# EasyEDA Pro project PCB_SCH_Right_Sub.epro

# Schematic right_sub
Board Name: right_sub; Create Date: 2025-10-24; Page Name: Sheet_1; Project Name: SCH_right_sub; Schematic Name: right_sub; Update Date: 2025-10-23; Add into BOM: yes; Company: Your Company; Convert to PCB: yes; Date: 10/24/2025; Draw By: Habana; REV: 1.0; Sheet: 1/1; spicePre: .
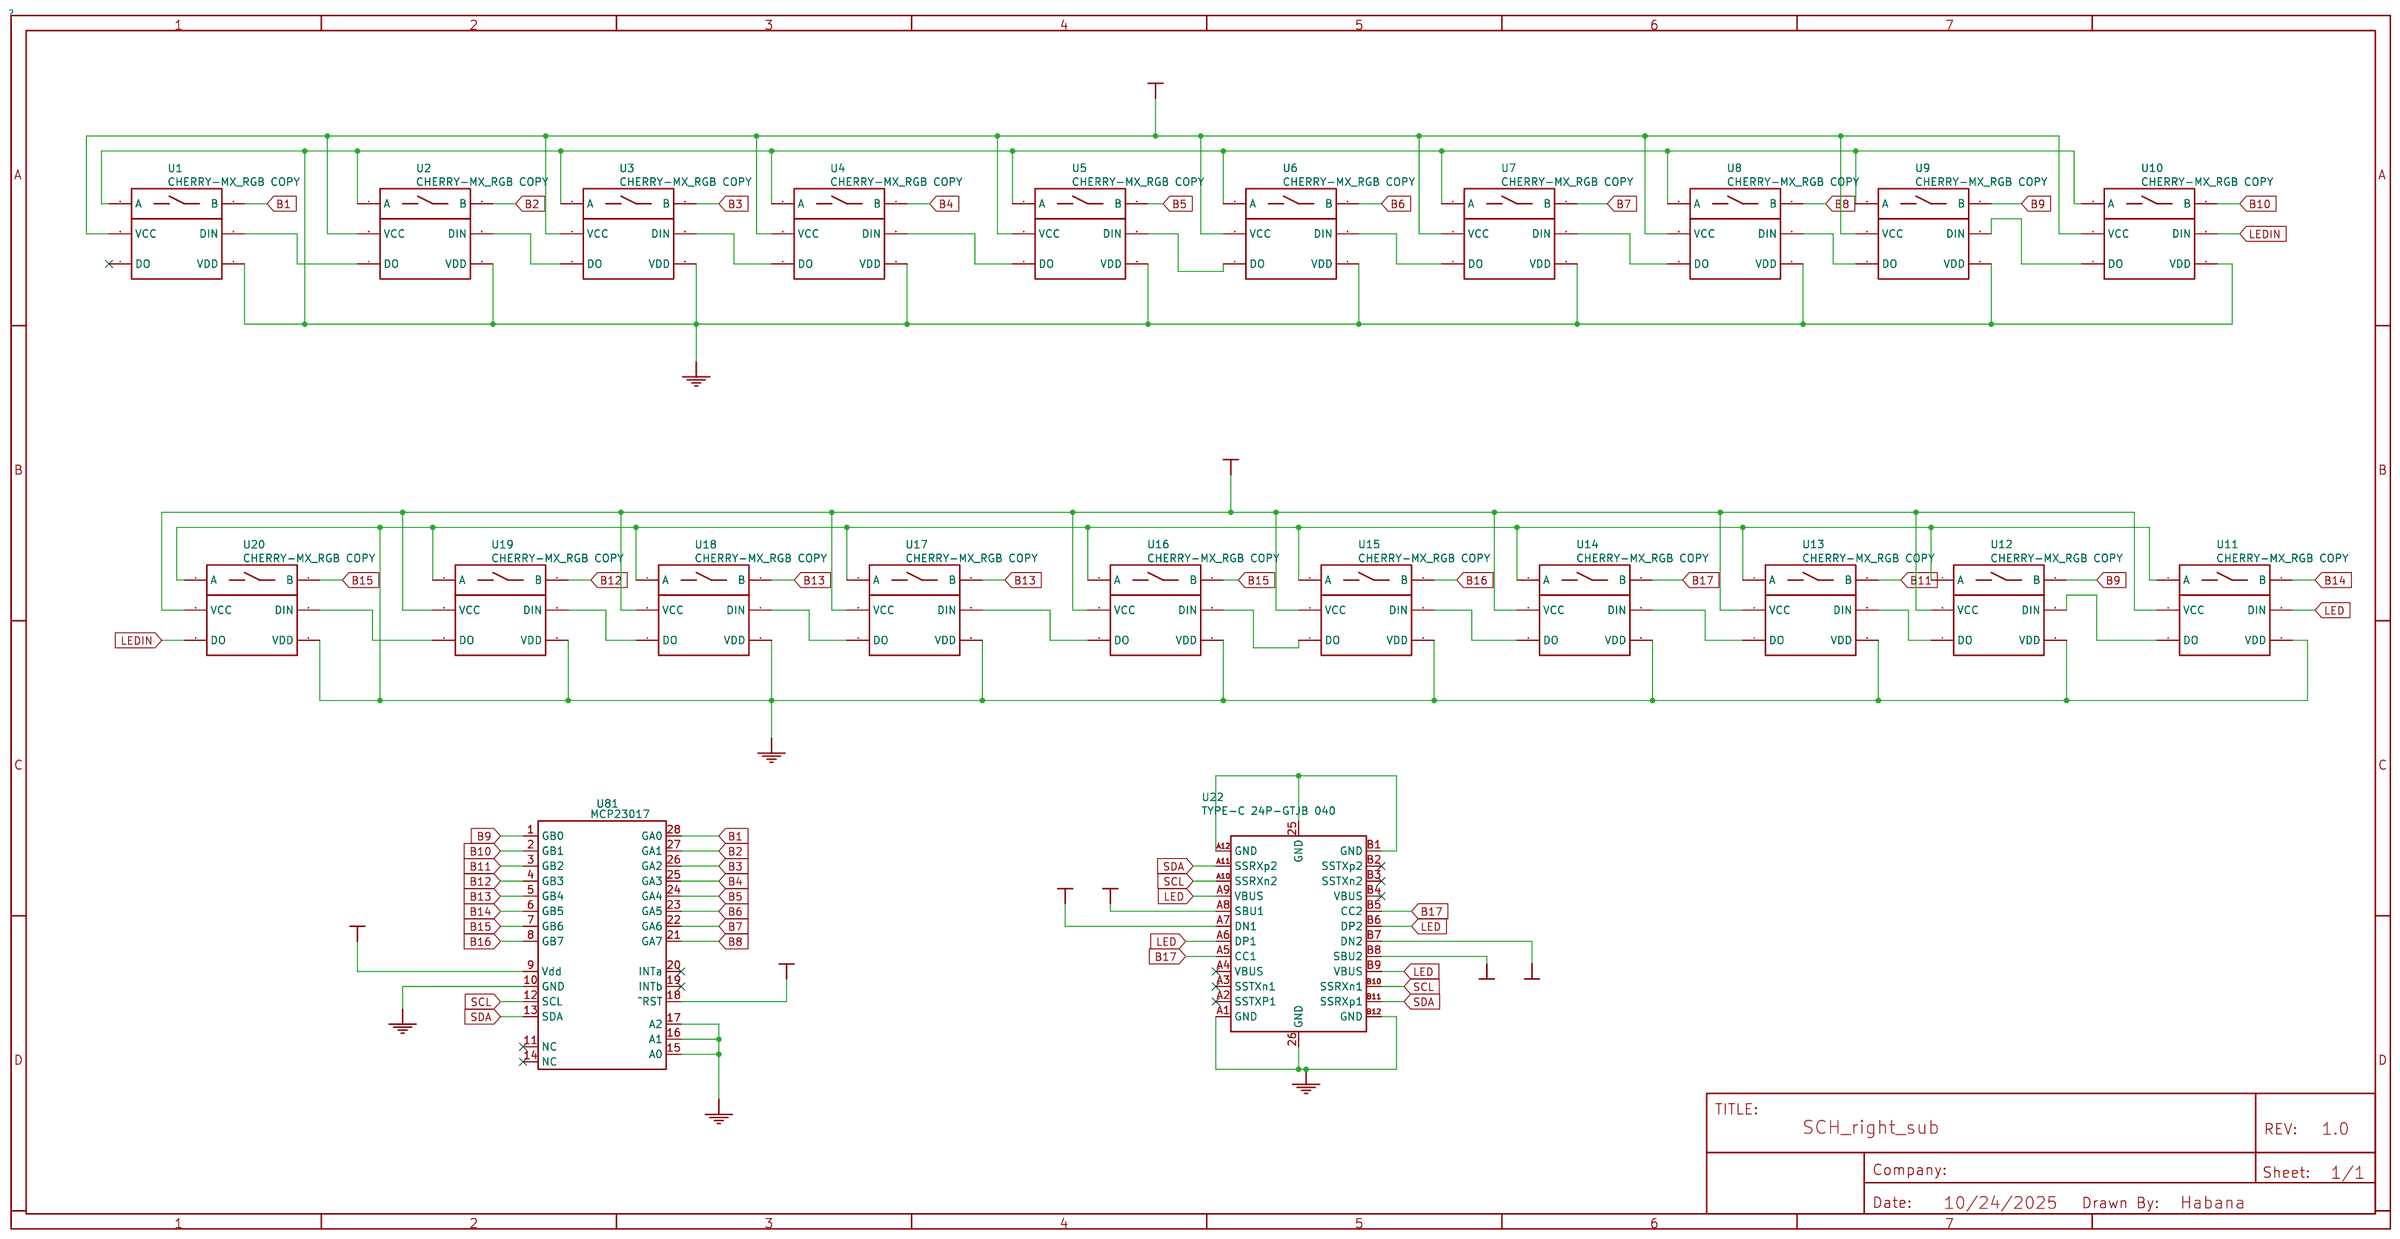
[diagram p0: schematic sheet]

## Parts
U1  CHERRY-MX_RGB COPY
U2  CHERRY-MX_RGB COPY
U3  CHERRY-MX_RGB COPY
U4  CHERRY-MX_RGB COPY
U5  CHERRY-MX_RGB COPY
U6  CHERRY-MX_RGB COPY
U7  CHERRY-MX_RGB COPY
U8  CHERRY-MX_RGB COPY
U9  CHERRY-MX_RGB COPY
U10  CHERRY-MX_RGB COPY
U11  CHERRY-MX_RGB COPY
U12  CHERRY-MX_RGB COPY
U13  CHERRY-MX_RGB COPY
U14  CHERRY-MX_RGB COPY
U15  CHERRY-MX_RGB COPY
U16  CHERRY-MX_RGB COPY
U17  CHERRY-MX_RGB COPY
U18  CHERRY-MX_RGB COPY
U19  CHERRY-MX_RGB COPY
U20  CHERRY-MX_RGB COPY
U22  TYPE-C 24P-GTJB 040  [USB-C-SMD_TYPE-C-24P-GTJB-040]
U81  MCP23017

## Library data of the parts
U1-U20 = CHERRY-MX_RGB COPY: Contributor: unrealin01; spicePre: U
U22 = TYPE-C 24P-GTJB 040: Supplier: LCSC; Supplier Part: C3151751; Manufacturer: SHOU HAN(首韩); JLCPCB Part Class: Extended Part; Contributor: lcsc; spicePre: U
U81 = MCP23017: nameAlias: Model; catid: 20; spicePre: X; Contributor: tsvstar

## Nets
+5V: U1.3(VCC) U2.3(VCC) U3.3(VCC) U4.3(VCC) U5.3(VCC) U6.3(VCC) U7.3(VCC) U8.3(VCC) U9.3(VCC) U10.3(VCC) U11.3(VCC) U12.3(VCC) U13.3(VCC) U14.3(VCC) U15.3(VCC) U16.3(VCC) U17.3(VCC) U18.3(VCC) U19.3(VCC) U20.3(VCC) U22.A8(SBU1) U22.B8(SBU2)
GND: U1.1(A) U1.5(VDD) U2.1(A) U2.5(VDD) U3.1(A) U3.5(VDD) U4.1(A) U4.5(VDD) U5.1(A) U5.5(VDD) U6.1(A) U6.5(VDD) U7.1(A) U7.5(VDD) U8.1(A) U8.5(VDD) U9.1(A) U9.5(VDD) U10.1(A) U10.5(VDD) U11.1(A) U11.5(VDD) U12.1(A) U12.5(VDD) U13.1(A) U13.5(VDD) U14.1(A) U14.5(VDD) U15.1(A) U15.5(VDD) U16.1(A) U16.5(VDD) U17.1(A) U17.5(VDD) U18.1(A) U18.5(VDD) U19.1(A) U19.5(VDD) U20.1(A) U20.5(VDD) U22.26(GND) U22.A1(GND) U22.B12(GND) U81.10(GND) U81.15(A0) U81.16(A1) U81.17(A2)
VCC: U22.A7(DN1) U22.B7(DN2) U81.9(Vdd) U81.18(^RST)
B1: U1.2(B) U81.28(GA0)
B2: U2.2(B) U81.27(GA1)
B3: U3.2(B) U81.26(GA2)
B4: U4.2(B) U81.25(GA3)
B5: U5.2(B) U81.24(GA4)
B6: U6.2(B) U81.23(GA5)
B7: U7.2(B) U81.22(GA6)
B8: U8.2(B) U81.21(GA7)
B9: U9.2(B) U12.2(B) U81.1(GB0)
B10: U10.2(B) U81.2(GB1)
B11: U13.2(B) U81.3(GB2)
B12: U19.2(B) U81.4(GB3)
B13: U17.2(B) U18.2(B) U81.5(GB4)
B14: U11.2(B) U81.6(GB5)
B15: U16.2(B) U20.2(B) U81.7(GB6)
B16: U15.2(B) U81.8(GB7)
B17: U14.2(B) U22.A5(CC1) U22.B5(CC2)
LED: U11.6(DIN) U22.A6(DP1) U22.A9(VBUS) U22.B6(DP2) U22.B9(VBUS)
LEDIN: U10.6(DIN) U20.4(DO)
SCL: U22.A10(SSRXn2) U22.B10(SSRXn1) U81.12(SCL)
SDA: U22.A11(SSRXp2) U22.B11(SSRXp1) U81.13(SDA)
U1_6: U1.6(DIN) U2.4(DO)
U2_6: U2.6(DIN) U3.4(DO)
U3_6: U3.6(DIN) U4.4(DO)
U4_6: U4.6(DIN) U5.4(DO)
U5_6: U5.6(DIN) U6.4(DO)
U6_6: U6.6(DIN) U7.4(DO)
U7_6: U7.6(DIN) U8.4(DO)
U8_6: U8.6(DIN) U9.4(DO)
U9_6: U9.6(DIN) U10.4(DO)
U11_4: U11.4(DO) U12.6(DIN)
U12_4: U12.4(DO) U13.6(DIN)
U13_4: U13.4(DO) U14.6(DIN)
U14_4: U14.4(DO) U15.6(DIN)
U15_4: U15.4(DO) U16.6(DIN)
U16_4: U16.4(DO) U17.6(DIN)
U17_4: U17.4(DO) U18.6(DIN)
U18_4: U18.4(DO) U19.6(DIN)
U19_4: U19.4(DO) U20.6(DIN)
U22_A12: U22.25(GND) U22.A12(GND) U22.B1(GND)

Not connected (* = marked no-connect by the designer): U1 4(DO)*; U22 A2(SSTXP1)* A3(SSTXn1)* A4(VBUS)* B2(SSTXp2)* B3(SSTXn2)* B4(VBUS)*; U81 11(NC)* 14(NC)* 19(INTb)* 20(INTa)*

# Board PCB_PCB_right_sub
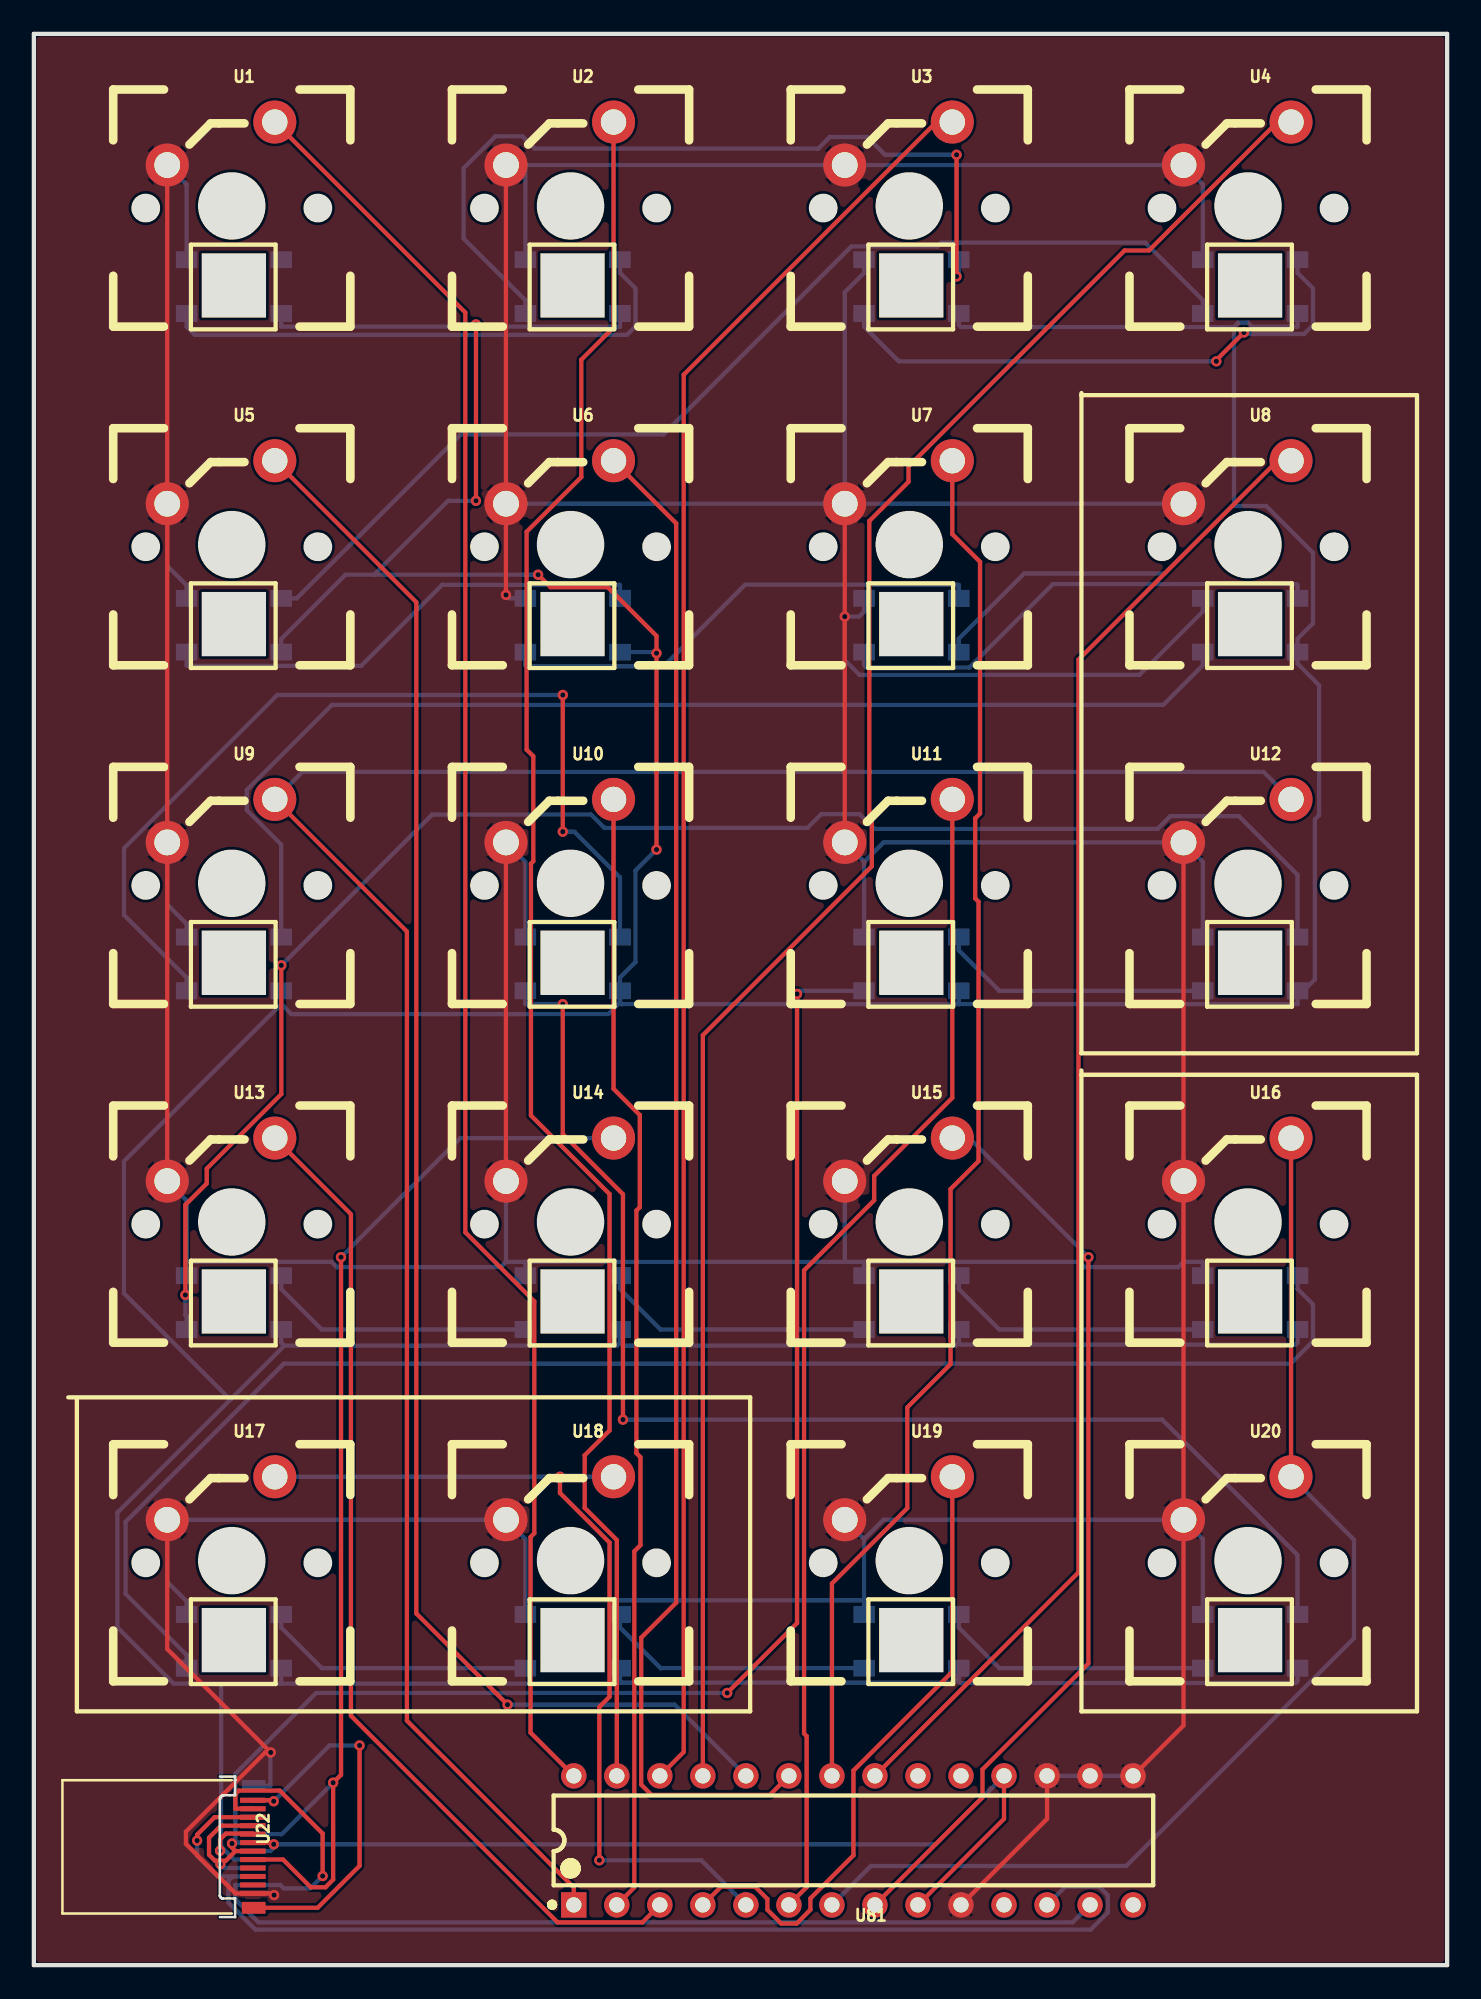
[diagram p1: board, top side]
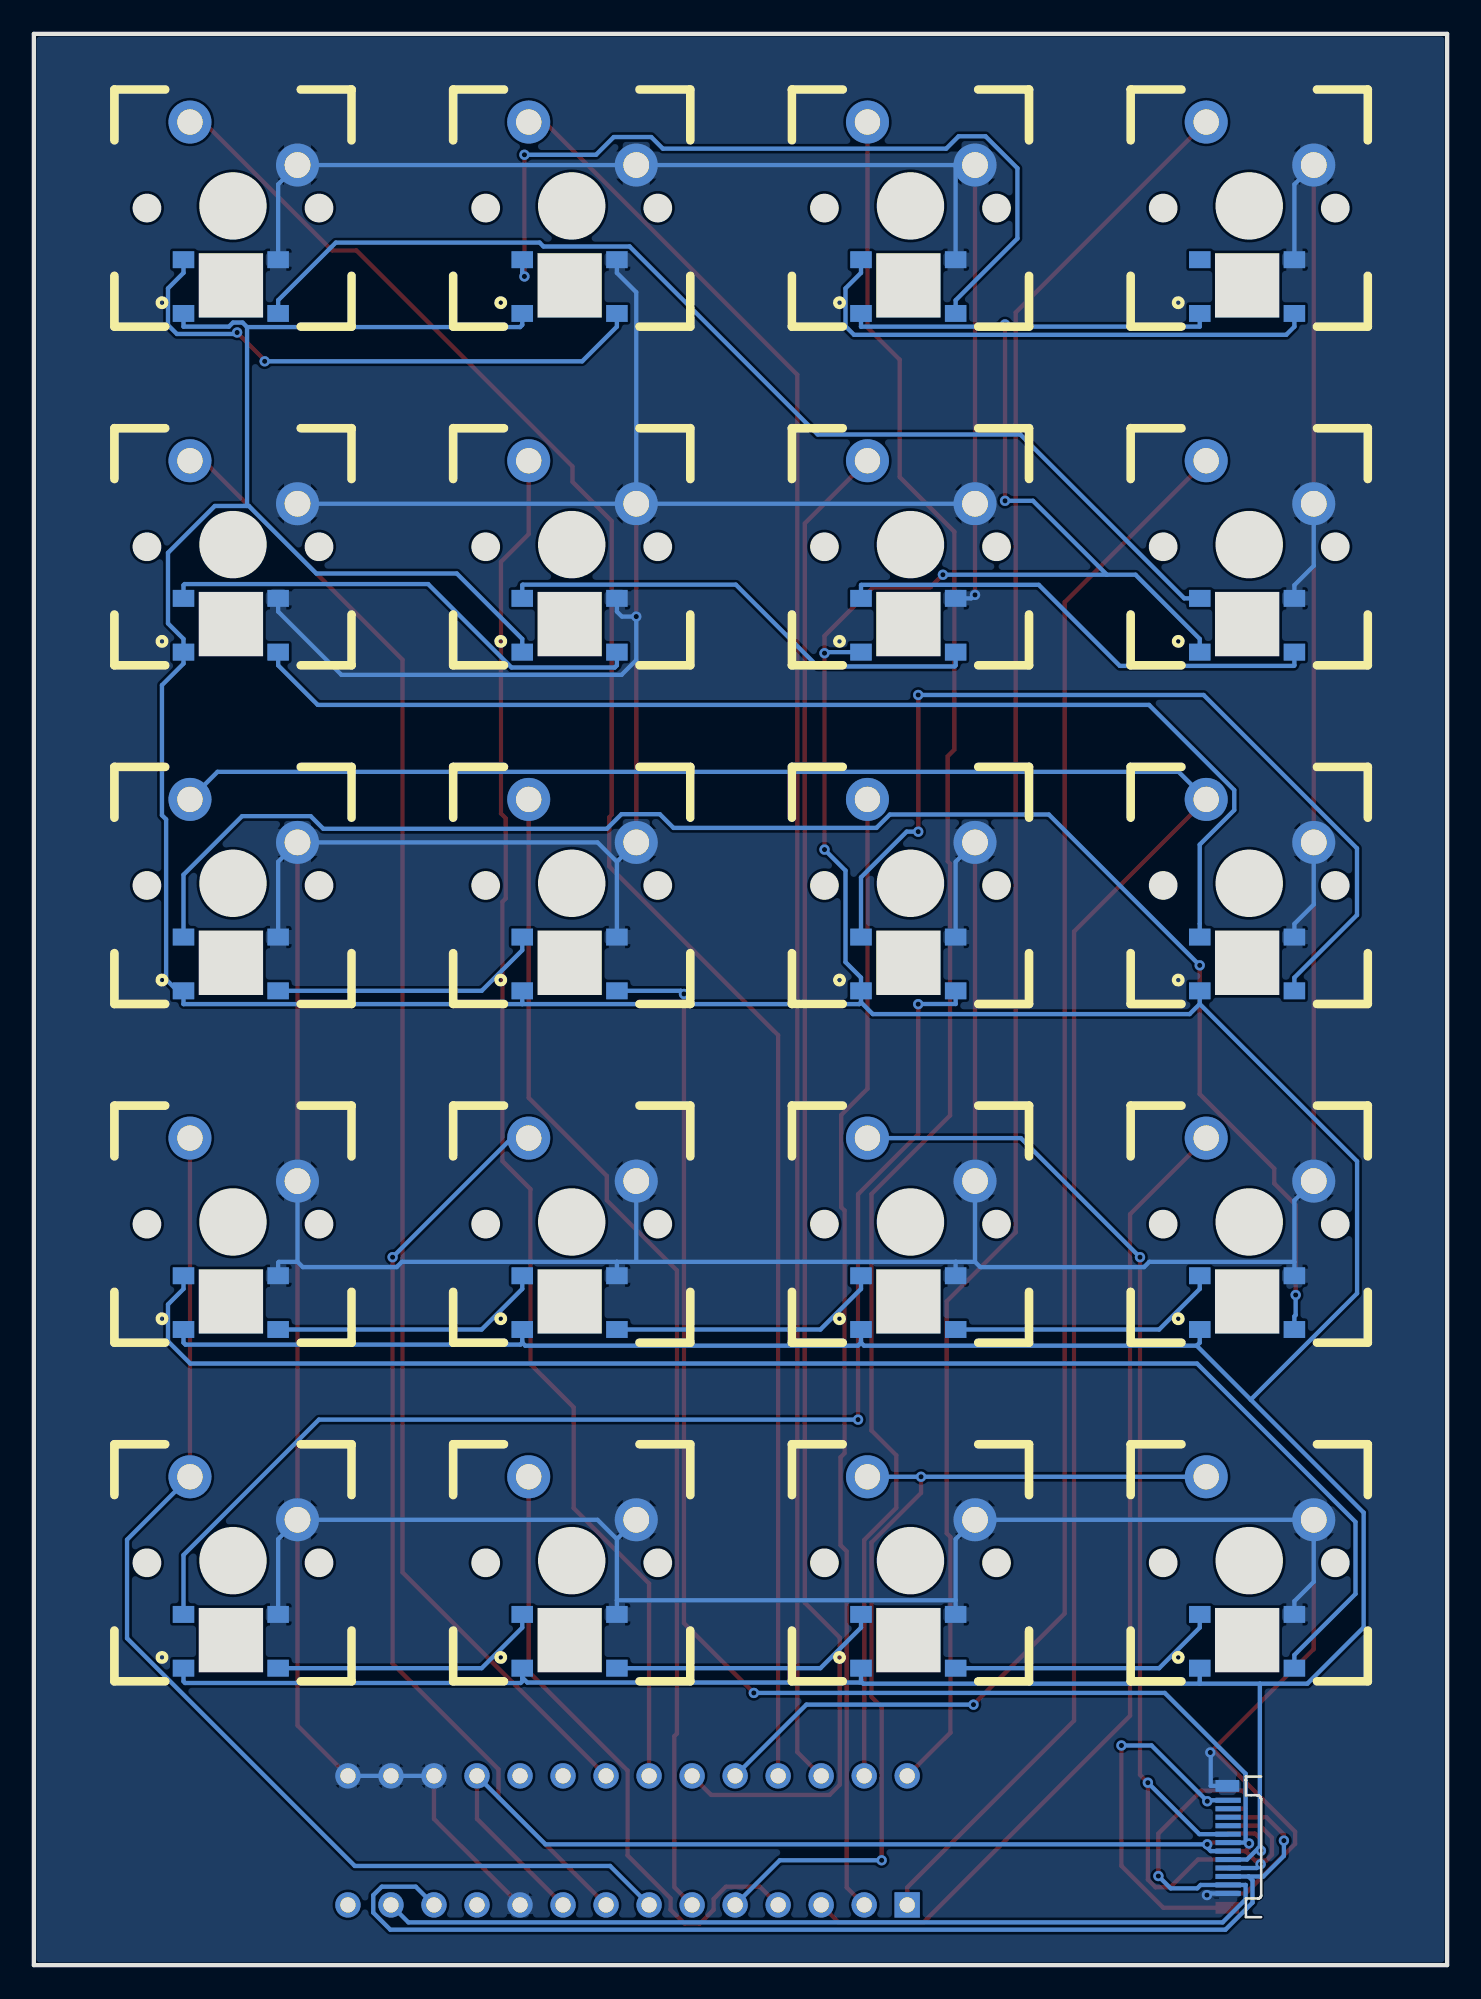
[diagram p2: board, bottom side, seen from below]

Outline 83.44 x 114.05 mm; copper layers: Top Layer, Bottom Layer. Coordinates in mm from the lower left corner of the outline.
Outline path: 0,114.05 83.44,114.05 83.44,0 0,0 0,114.05

## Design rules (mm)
via Default (default): diameter min 0.61, default 0.61, max 100.025; hole min 0.305, default 0.305, max 59.995
pour e205 uses gge21262
pour e589 uses gge21280

## Placement (name value [footprint] x y rotation side)
U1  CHERRY-MX_RGB COPY  [CHERRY-MX-RGB]  13.72 96.9 0 top
U2  CHERRY-MX_RGB COPY  [CHERRY-MX-RGB]  33.72 96.9 0 top
U3  CHERRY-MX_RGB COPY  [CHERRY-MX-RGB]  53.72 96.9 0 top
U4  CHERRY-MX_RGB COPY  [CHERRY-MX-RGB]  73.72 96.9 0 top
U5  CHERRY-MX_RGB COPY  [CHERRY-MX-RGB]  13.72 76.9 0 top
U6  CHERRY-MX_RGB COPY  [CHERRY-MX-RGB]  33.72 76.9 0 top
U7  CHERRY-MX_RGB COPY  [CHERRY-MX-RGB]  53.72 76.9 0 top
U8  CHERRY-MX_RGB COPY  [CHERRY-MX-RGB]  73.72 76.9 0 top
U9  CHERRY-MX_RGB COPY  [CHERRY-MX-RGB]  13.72 56.9 0 top
U10  CHERRY-MX_RGB COPY  [CHERRY-MX-RGB]  33.72 56.9 0 top
U11  CHERRY-MX_RGB COPY  [CHERRY-MX-RGB]  53.72 56.9 0 top
U12  CHERRY-MX_RGB COPY  [CHERRY-MX-RGB]  73.72 56.9 0 top
U13  CHERRY-MX_RGB COPY  [CHERRY-MX-RGB]  13.72 36.9 0 top
U14  CHERRY-MX_RGB COPY  [CHERRY-MX-RGB]  33.72 36.9 0 top
U15  CHERRY-MX_RGB COPY  [CHERRY-MX-RGB]  53.72 36.9 0 top
U16  CHERRY-MX_RGB COPY  [CHERRY-MX-RGB]  73.72 36.9 0 top
U17  CHERRY-MX_RGB COPY  [CHERRY-MX-RGB]  13.72 16.9 0 top
U18  CHERRY-MX_RGB COPY  [CHERRY-MX-RGB]  33.72 16.9 0 top
U19  CHERRY-MX_RGB COPY  [CHERRY-MX-RGB]  53.72 16.9 0 top
U20  CHERRY-MX_RGB COPY  [CHERRY-MX-RGB]  73.72 16.9 0 top
U22  TYPE-C 24P-GTJB 040  [USB-C-SMD_TYPE-C-24P-GTJB-040]  12.95 6.99 270 top
U81  MCP23017  [DIP-28_300MIL]  48.39 7.37 180 top

## Footprints (pads in the part's own frame, mm; a bottom-side part is the same pattern mirrored in y, then rotated)
CHERRY-MX-RGB
  round 2.54 hole 1.524: 1(-5.842,9.398)
  round 2.54 hole 1.5: 2(0.508,11.938)
  rect 1.27x1 smd far side: 3(0.889,0.635) 4(0.889,3.81) 5(-4.699,3.81) 6(-4.699,0.635)
DIP-28_300MIL
  rect 1.5x1.5 hole 0.9: 1(16.51,3.81)
  round 1.5 hole 0.9: 2(13.97,3.81) 3(11.43,3.81) 4(8.89,3.81) 5(6.35,3.81) 6(3.81,3.81) 7(1.27,3.81) 8(-1.27,3.81) 9(-3.81,3.81) 10(-6.35,3.81) 11(-8.89,3.81) 12(-11.43,3.81) 13(-13.97,3.81) 14(-16.51,3.81) 15(-16.51,-3.81) 16(-13.97,-3.81) 17(-11.43,-3.81) 18(-8.89,-3.81) 19(-6.35,-3.81) 20(-3.81,-3.81) 21(-1.27,-3.81) 22(1.27,-3.81) 23(3.81,-3.81) 24(6.35,-3.81) 25(8.89,-3.81) 26(11.43,-3.81) 27(13.97,-3.81) 28(16.51,-3.81)
USB-C-SMD_TYPE-C-24P-GTJB-040
  rect 0.7x1.4 smd: 25(3.6,0.025)
  rect 0.7x1.4 smd far side: 26(-3.6,0.025)
  rect 0.3x1.5 smd: A1(2.75,-0.025) A2(2.25,-0.025) A3(1.75,-0.025) A4(1.25,-0.025) A5(0.75,-0.025) A6(0.25,-0.025) A7(-0.25,-0.025) A8(-0.75,-0.025) A9(-1.25,-0.025) A10(-1.75,-0.025) A11(-2.25,-0.025) A12(-2.75,-0.025)
  rect 0.3x1.5 smd far side: B1(-2.75,-0.025) B2(-2.25,-0.025) B3(-1.75,-0.025) B4(-1.25,-0.025) B5(-0.75,-0.025) B6(-0.25,-0.025) B7(0.25,-0.025) B8(0.75,-0.025) B9(1.25,-0.025) B10(1.75,-0.025) B11(2.25,-0.025) B12(2.75,-0.025)

## Nets
As in the schematic.

Pads without a net: U1 4; U22 A2 A3 A4 B2 B3 B4; U81 11 14 19 20

## Via types
v1: diameter 0.61, hole 0.305, Top Layer to Bottom Layer, 35 vias

## Routing (per net, layer and track width the routed paths; a pad name or vN(x,y) marks a point on that pad's centre or on a via; arc(x,y) is an arc through that point)
+5V: length 443
  Top Layer w0.254: v1(36.76,65.88) v1(36.76,77.47) 36.76,78.5 33.88,81.37 30.5,81.37 v1(29.77,82.11) ; v1(10.99,6.76) 10.99,7.42 11.34,7.77 12.89,7.77 U22.A8 ; v1(26.1,86.47) v1(26.1,96.89)
  Bottom Layer w0.254: 70.85,86.17 72.75,86.17 75.52,83.4 75.52,79.23 74.61,78.32 U8.3 74.61,76.86 75.88,75.59 75.88,67.9 75.63,67.66 75.63,58.21 74.61,57.18 ; 70.85,86.17 70.75,86.17 66.76,82.18 58.47,82.18 54.61,78.32 U7.3 ; 70.85,86.17 70.85,96.73 ; 14.78,36.58 11.59,33.39 ; 14.78,36.58 14.6,36.76 U13.3 ; 14.78,36.58 34.43,36.58 34.61,36.76 ; 11.59,33.39 4.93,26.72 4.93,19.95 8.25,16.62 11.06,16.62 ; 11.59,33.39 5.32,39.67 5.32,47.47 14.6,56.76 ; U3.3 54.61,96.86 54.73,96.73 70.85,96.73 ; 11.06,16.62 14.6,16.62 ; 11.06,16.62 11.06,7 11.14,6.91 ; 14.6,16.62 34.47,16.62 34.61,16.76 ; 14.6,16.62 U17.3 ; 34.61,56.86 34.71,56.75 54.61,56.75 ; 34.61,56.86 33.91,56.16 15.2,56.16 14.6,56.76 ; 34.61,56.86 U10.3 34.61,58.32 35.52,59.23 35.52,64.64 v1(36.76,65.88) ; 34.61,16.76 34.68,16.69 54.3,16.69 54.61,16.99 ; 34.61,16.76 U18.3 ; 14.6,56.76 U9.3 ; v1(36.76,77.47) 36.7,77.54 U6.3 ; 54.61,36.76 U15.3 ; 54.61,36.76 54.43,36.58 34.78,36.58 34.61,36.76 ; 54.61,36.76 54.72,36.64 74.49,36.64 74.61,36.76 U16.3 ; 70.85,96.73 71.12,97 71.68,97 71.92,96.76 74.61,96.76 U4.3 ; 26.1,96.76 14.6,96.76 U1.3 ; 26.1,96.76 26.1,96.76 34.6,96.76 34.61,96.76 U2.3 ; 26.1,96.76 v1(26.1,96.89) ; 54.61,16.99 54.61,16.76 54.7,16.66 74.51,16.66 74.61,16.76 U20.3 ; 54.61,16.99 U19.3 ; 34.61,36.76 U14.3 ; 11.14,6.91 v1(10.99,6.76) ; 11.14,6.91 11.82,6.24 U22.B8 ; 54.61,56.75 U11.3 ; 54.61,56.75 74.6,56.75 74.61,56.76 74.61,57.18 ; 74.61,57.18 U12.3 ; 20.09,82.11 v1(29.77,82.11) ; 20.09,82.11 24.45,86.47 v1(26.1,86.47) ; 20.09,82.11 18.4,82.11 14.6,78.32 U5.3
GND: length 590
  Top Layer w0.254: U12.1 U16.1 U20.1 67.87,14.15 U81.15 ; U1.1 U5.1 U9.1 U13.1 ; 27.87,80.92 U6.1 U2.1 ; U7.1 v1(47.87,79.64) U11.1 ; v1(14.18,4.14) 14.08,4.24 U22.A1 11.9,4.24 8.98,7.16 8.98,7.88 13.65,12.56 v1(13.98,12.56) 7.87,18.67 U17.1 ; U81.10 59.82,8.64 U81.17 ; U10.1 U14.1
  Bottom Layer w0.254: 67.87,41.53 67.56,41.22 62.02,41.22 61.7,41.53 49.02,41.53 ; 67.87,41.53 U16.1 ; 67.87,41.53 68.97,41.53 69.02,41.49 U16.5 ; 47.87,41.53 49.02,41.53 ; 47.87,41.53 U15.1 ; 47.87,41.53 29.02,41.53 ; 49.02,41.53 U15.5 ; U10.1 29.02,65.16 U10.5 ; 29.02,21.55 U18.5 ; 29.02,21.55 49.02,21.55 ; 29.02,21.55 29.02,25.16 U18.1 U17.1 7.87,22.63 9.02,21.49 U17.5 ; 49.02,21.55 49.02,25.16 ; 49.02,21.55 U19.5 ; 29.02,41.53 27.87,41.53 ; 29.02,41.53 U14.5 ; 49.02,25.16 50.16,26.3 U20.1 69.02,25.16 U20.5 ; 49.02,25.16 U19.1 ; U5.1 7.87,82.63 9.02,81.49 U5.5 ; 27.87,41.53 27.56,41.22 17.89,41.22 17.58,41.53 9.02,41.53 ; 27.87,41.53 U14.1 ; U6.1 U7.1 ; U7.1 47.87,98.79 49.02,99.93 U3.5 ; U7.1 U8.1 ; v1(14.18,4.14) 14.06,4.14 13.96,4.24 U22.A1 ; U8.5 69.02,79.93 65.28,76.2 48.74,76.2 47.87,77.06 v1(47.87,79.64) 48.72,79.64 49.02,79.93 U7.5 ; 29.02,106.3 U2.5 ; 29.02,106.3 U3.1 U4.1 69.02,105.16 U4.5 ; 29.02,106.3 U2.1 ; 27.87,80.92 27.9,80.92 28.1,80.71 U6.5 ; U22.26 13.96,10.59 13.96,12.53 v1(13.98,12.56) ; U1.5 9.02,105.16 U1.1 ; U81.15 U81.16 U81.17 ; 9.02,41.53 U13.5 ; 9.02,41.53 9.02,45.16 U13.1 ; U11.1 49.02,65.16 ; 49.02,65.16 50.16,66.3 U12.1 69.02,65.16 U12.5 ; 49.02,65.16 U11.5 ; U9.5 9.02,61.49 7.87,62.63 U9.1
  vias: v1(27.87,80.92)
VCC: length 57.3
  Top Layer w0.254: v1(14.16,7.13) 14.06,7.24 U22.A7 ; U81.9 57.28,8.64 U81.18
  Bottom Layer w0.254: U81.18 53.23,7.13 v1(14.16,7.13) 14.16,6.94 13.96,6.74 U22.B7
B1: length 105.2
  Top Layer w0.254: U1.2 25.47,97.59 25.47,43.27 29.55,39.2 29.55,25.5 29.33,25.28 29.33,13.73 U81.28
B2: length 103.3
  Top Layer w0.254: U81.27 34.42,25.1 32.52,27 32.52,30.11 33.99,31.57 33.99,45.53 29.35,50.17 29.35,65.05 29.49,65.19 29.49,71.38 29.09,71.78 29.09,84.65 32.32,87.87 32.32,94.8 34.22,96.71 U2.2
B3: length 105.4
  Top Layer w0.254: U81.26 38.37,12.59 38.37,93.92 53.28,108.84 U3.2
B4: length 113.5
  Top Layer w0.254: U4.2 73.42,108.84 65.84,101.26 64.4,101.26 51.64,88.5 51.64,87.59 49.33,85.28 49.33,67.93 49.47,67.79 49.47,64.89 39.5,54.92 U81.25
B5: length 95
  Top Layer w0.254: 27.96,15.38 22.58,20.77 22.58,80.48 U5.2
  Bottom Layer w0.254: 27.96,15.38 37.83,15.38 U81.24
  vias: v1(27.96,15.38)
B6: length 90
  Top Layer w0.254: U81.23 43.45,10.05 36.46,10.05 35.86,10.66 35.86,19.34 37.92,21.4 37.92,85.14 U6.2
B7: length 82.1
  Top Layer w0.254: U7.2 54.22,84.51 55.86,82.87 55.86,68.01 55.58,67.72 55.58,62.99 55.77,62.8 55.77,47.48 54.12,45.83 54.12,35.49 51.57,32.94 51.57,26.99 47.12,22.54 U81.22
B8: length 88.3
  Top Layer w0.254: U81.21 61.67,23.19 61.67,77.09 73.42,88.84 U8.2
B9: length 133.9
  Top Layer w0.254: U81.1 31.88,4.59 22.02,14.44 22.02,61.04 U9.2
  Bottom Layer w0.254: U12.2 72.6,70.47 15.85,70.47 U9.2
B10: length 66.7
  Top Layer w0.254: U81.2 35.45,4.59 35.45,24.43 35.81,24.8 35.81,29.99 35.57,30.23 35.57,44.56 35.77,44.76 35.77,50.2 34.22,51.75 U10.2
B11: length 59.7
  Top Layer w0.254: U13.2 18.72,44.34 18.72,14.73 30.92,2.53 35.93,2.53 U81.3
B12: length 37.4
  Top Layer w0.254: U19.2 54.22,17.32 48.39,11.49 48.39,6.48 45.85,3.94 45.85,3.27 45.03,2.45 44.12,2.45 43.31,3.27 43.31,3.91 42.58,4.63 40.57,4.63 U81.4
B13: length 53.9
  Top Layer w0.254: v1(31.06,28.84) 31.06,27.88 33.99,24.96 33.99,15.85 33.39,15.25 33.39,6.19
  Bottom Layer w0.254: 33.39,6.19 39.4,6.19 U81.5 ; U17.2 v1(31.06,28.84) U18.2
  vias: v1(33.39,6.19)
B14: length 69.4
  Top Layer w0.254: U11.2 54.22,51.22 49.61,46.61 49.61,45.17 45.47,41.03 45.47,13.68 45.63,13.52 45.63,4.6 U81.6
B15: length 68.4
  Top Layer w0.254: U20.2 U16.2
  Bottom Layer w0.254: U81.7 49.42,5.86 64.49,5.86 77.94,19.3 77.94,25.12 U20.2
B16: length 54.4
  Top Layer w0.254: U81.8 56.01,9.91 56.01,11.56 62.26,17.81 v1(62.26,41.81)
  Bottom Layer w0.254: v1(62.26,41.81) 55.23,48.84 U15.2
B17: length 67.6
  Top Layer w0.254: U22.A5 14.71,6.24 16.35,4.6 17.22,4.6 17.67,5.05 v1(17.67,10.77) 18.13,11.24 v1(18.13,41.81)
  Bottom Layer w0.254: v1(17.67,10.77) 14.63,7.74 U22.B5 ; v1(18.13,41.81) 25.17,48.84 U14.2
LED: length 93
  Top Layer w0.254: U22.A6 11.9,6.74 ; 11.9,6.74 11.7,6.94 v1(11.7,7.18) ; 11.9,6.74 11.33,6.17 11.01,6.17 ; v1(45.06,57.35) 45.06,20.2 v1(40.93,16.07) ; 11.01,6.17 v1(11.01,5.97) ; 11.01,6.17 10.69,6.17 10.34,6.51 10.34,7.53 11.05,8.24 U22.A9
  Bottom Layer w0.254: U22.B9 11.24,5.74 v1(11.01,5.97) ; U22.B6 11.9,7.24 ; 11.9,7.24 11.85,7.18 v1(11.7,7.18) ; 11.9,7.24 11.9,7.24 11.9,11.3 16.67,16.07 v1(40.93,16.07) ; v1(45.06,57.35) 45.24,57.54 U11.6
LEDIN: length 75.6
  Top Layer w0.254: v1(34.78,32.21) 34.78,45.52 31.23,49.08 v1(31.23,56.75)
  Bottom Layer w0.254: U10.6 29.02,56.76 31.22,56.76 v1(31.23,56.75) ; U20.4 74.61,24.22 66.61,32.21 v1(34.78,32.21)
SCL: length 68.7
  Top Layer w0.254: v1(9.64,7.35) 9.64,7.7 10.67,8.74 U22.A10
  Bottom Layer w0.254: 11.72,5.24 10.85,5.24 9.64,6.45 v1(9.64,7.35) ; 11.72,5.24 U22.B10 ; 11.72,5.24 11.49,5 11.49,3.69 13.09,2.09 62.39,2.09 63.4,3.1 63.4,4.13 62.9,4.63 60.89,4.63 U81.12
SDA: length 68.5
  Top Layer w0.254: 17.05,5.26 17.05,7.77 14.51,10.31 12.1,10.31 11.9,10.1 11.9,9.24 11.9,9.24 U22.A11
  Bottom Layer w0.254: 17.05,5.26 16.32,4.53 14.75,4.53 14.55,4.74 U22.B11 11.9,4.74 11.9,4.73 11.9,3.88 13.25,2.53 61.33,2.53 U81.13
  vias: v1(17.05,5.26)
U1_6: length 32
  Bottom Layer w0.254: U1.6 9.02,96.76 9.5,96.27 35.02,96.27 35.52,96.78 35.52,99.02 34.61,99.93 U2.4
U2_6: length 49.2
  Top Layer w0.254: v1(54.48,99.72) v1(54.48,106.91)
  Bottom Layer w0.254: v1(54.48,106.91) 50.25,106.91 49.2,107.95 46.99,107.95 46.3,107.27 29.58,107.27 28.84,108 27.25,108 25.37,106.11 25.37,101.96 29.02,98.32 U2.6 ; v1(54.48,99.72) 54.48,99.8 54.61,99.93 U3.4
U3_6: length 33.4
  Top Layer w0.254: v1(71.44,96.41) 69.81,94.79 v1(69.81,94.71)
  Bottom Layer w0.254: U3.6 49.02,96.76 51.06,94.71 v1(69.81,94.71) ; U4.4 74.61,99.93 75.52,99.02 75.52,96.85 74.99,96.32 71.53,96.32 v1(71.44,96.41)
U4_6: length 65.3
  Bottom Layer w0.254: U5.4 15.52,80.71 25.2,90.39 37.16,90.39 48.27,101.49 53.35,101.49 53.58,101.72 65.61,101.72 69.02,98.32 U4.6
U5_6: length 29.2
  Bottom Layer w0.254: U6.4 34.61,81.49 34.59,81.51 24.11,81.51 19.32,76.72 9.05,76.72 9.02,76.76 U5.6
U6_6: length 29.2
  Bottom Layer w0.254: U6.6 29.02,76.76 29.08,76.69 37.17,76.69 41.99,81.52 54.58,81.52 54.61,81.49 U7.4
U7_6: length 29.3
  Bottom Layer w0.254: U7.6 49.02,76.76 49.14,76.63 55.24,76.63 60.16,81.56 74.54,81.56 74.61,81.49 U8.4
U8_6: length 69.8
  Bottom Layer w0.254: U9.4 14.6,66.17 12.57,68.21 12.57,69.39 17.6,74.42 66.68,74.42 69.02,76.76 U8.6
U9_6: length 55.7
  Top Layer w0.254: v1(31.23,66.93) v1(31.23,75.01)
  Bottom Layer w0.254: v1(31.23,66.93) 31.91,66.93 34.61,64.24 U10.4 ; U9.6 9.02,58.32 5.32,62.01 5.32,65.95 14.38,75.01 v1(31.23,75.01)
U11_4: length 16.2
  Bottom Layer w0.254: U11.4 54.61,59.93 57,57.54 U12.6
U12_4: length 94
  Top Layer w0.254: v1(14.61,59.04) 14.61,51.44 10.21,47.04 10.21,46.16 8.94,44.9 v1(8.94,39.57)
  Bottom Layer w0.254: v1(8.94,39.57) 8.94,38.39 9.02,38.32 U13.6 ; U12.4 74.61,64.39 71.14,67.85 67.1,67.85 66.35,67.1 49.61,67.1 48.75,67.97 46.48,67.97 45.67,67.16 33.69,67.16 32.9,67.95 23.52,67.95 v1(14.61,59.04)
U13_4: length 16.2
  Bottom Layer w0.254: U14.6 17,37.54 14.6,39.93 U13.4
U14_4: length 16.2
  Bottom Layer w0.254: U14.4 34.61,39.93 37,37.54 U15.6
U15_4: length 16.2
  Bottom Layer w0.254: U16.6 57,37.54 54.61,39.93 U15.4
U16_4: length 88.9
  Bottom Layer w0.254: U17.6 9.02,18.32 5.41,21.92 5.41,26.17 14.76,35.52 74.2,35.52 75.52,36.84 75.52,39.02 74.61,39.93 U16.4
U17_4: length 16.2
  Bottom Layer w0.254: U17.4 14.6,19.93 17,17.54 U18.6
U18_4: length 16.2
  Bottom Layer w0.254: U18.4 34.61,19.93 37,17.54 U19.6
U19_4: length 16.2
  Bottom Layer w0.254: U19.4 54.61,19.93 57,17.54 U20.6
U22_A12: length 23.3
  Top Layer w0.254: v1(19.23,12.97) 19.23,5.86 16.75,3.39 U22.25 ; U22.A12 13.96,9.74 14.02,9.68 v1(14.16,9.68)
  Bottom Layer w0.254: U22.A12 14.1,9.74 v1(14.16,9.68) 17.45,12.97 v1(19.23,12.97)

## Copper pours and planes (outline as drawn; the poured copper is in the pictures)
GND on Top Layer: -5.46,117.86 88.01,117.86 88.01,-1.78 90.04,-3.81 -5.46,-3.81 -6.48,-4.83
GND on Bottom Layer: -7.24,119.51 90.68,119.51 91.06,119.89 91.06,1.4 87.25,-2.41 -3.81,-2.41 -4.45,-1.78
